# Altium schematic sheet CON_NB2_EXTEND_A40.SchDoc: NB2-Extender A 16-Pin Header
size A4; Organization: Altium Limited.; Address1: Level 3, 12a Rodborough Rd; Address2: Frenchs Forest 2086; Address3: NSW; Address4: AUSTRALIA; Revision: 6; SheetNumber: 54; SheetTotal: 64
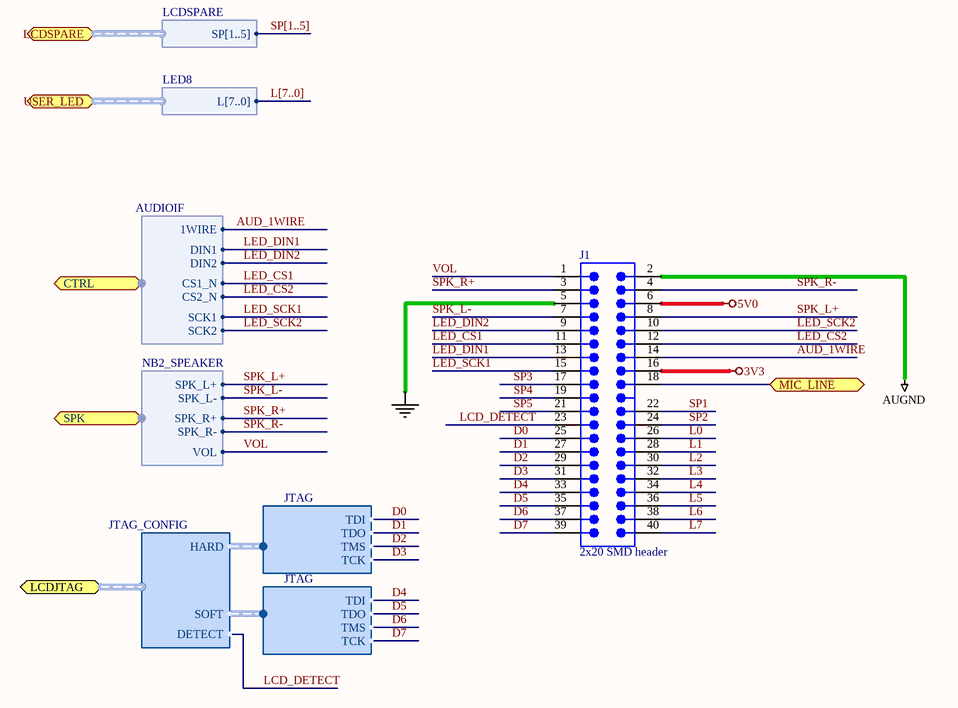
[diagram p0: CON_NB2_EXTEND_A40.SchDoc]

## Parts
J1  2x20 SMD header  [HDR2X20_SMT]

## Ports
CTRL (harness AUDIOIF), LCDJTAG (harness JTAG_CONFIG), LCDSPARE (harness LCDSPARE), MIC_LINE (bidir), SPK (harness NB2_SPEAKER), USER_LED (harness LED8)

## Harnesses
NB2_SPEAKER: SPK_L-, SPK_L+, SPK_R-, SPK_R+, VOL
AUDIOIF: CS1_N, CS2_N, SCK1, 1WIRE, DIN1, DIN2, SCK2
LED8: L[7..0]
LCDSPARE: SP[1..5]
JTAG: TMS, TDO, TDI, TCK
JTAG_CONFIG: HARD, SOFT, DETECT

## Nets
3V3: J1.16
5V0: J1.6
AUGND: J1.2
GND: J1.5
AUD_1WIRE: J1.14 ; port CTRL.1WIRE
D0: J1.25 ; harness JTAG.TDI
D1: J1.27 ; harness JTAG.TDO
D2: J1.29 ; harness JTAG.TMS
D3: J1.31 ; harness JTAG.TCK
D4: J1.33 ; harness JTAG.TDI
D5: J1.35 ; harness JTAG.TDO
D6: J1.37 ; harness JTAG.TMS
D7: J1.39 ; harness JTAG.TCK
L0: J1.26
L1: J1.28
L2: J1.30
L3: J1.32
L4: J1.34
L5: J1.36
L6: J1.38
L7: J1.40
LCD_DETECT: J1.23 ; port LCDJTAG.DETECT
LED_CS1: J1.11 ; port CTRL.CS1_N
LED_CS2: J1.12 ; port CTRL.CS2_N
LED_DIN1: J1.13 ; port CTRL.DIN1
LED_DIN2: J1.9 ; port CTRL.DIN2
LED_SCK1: J1.15 ; port CTRL.SCK1
LED_SCK2: J1.10 ; port CTRL.SCK2
MIC_LINE: J1.18 ; port MIC_LINE
SP1: J1.22
SP2: J1.24
SP3: J1.17
SP4: J1.19
SP5: J1.21
SPK_L+: J1.8 ; port SPK.SPK_L+
SPK_L-: J1.7 ; port SPK.SPK_L-
SPK_R+: J1.3 ; port SPK.SPK_R+
SPK_R-: J1.4 ; port SPK.SPK_R-
VOL: J1.1 ; port SPK.VOL

## Buses and harness runs
bus L[7..0]
bus SP[1..5]

## Notes on the sheet
- Sheet Title
- Project Title
- Size:
- Date:
- A4
- Assy:
- Time:
- Sheet
- Revision:
- of
- File:

## Library data of the parts
J1 = D-300-0046: Header IDC, 2 x 20 pin SMD, Vertical; Max Current: mA; Connector type: Header; Mounting Technology: Surface Mount; Pin Count: 40; Status: Unreleased; Category: Connector